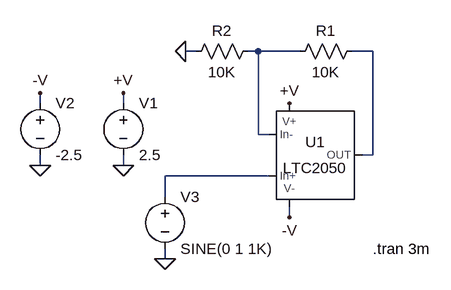
[diagram p0: schematic 2050.asc]
2050.asc, the LTspice schematic file:
Version 4
SHEET 1 896 680
WIRE -48 -64 -64 -64
WIRE 48 -64 32 -64
WIRE 112 -64 48 -64
WIRE 224 -64 192 -64
WIRE -288 16 -288 0
WIRE -160 16 -160 0
WIRE 48 64 48 -64
WIRE 64 64 48 64
WIRE 224 96 224 -64
WIRE 224 96 208 96
WIRE -288 112 -288 96
WIRE -160 112 -160 96
WIRE 64 128 -96 128
WIRE -96 160 -96 128
WIRE 96 192 96 176
WIRE -96 256 -96 240
FLAG -160 112 0
FLAG 96 16 +V
FLAG -160 0 +V
FLAG 96 192 -V
FLAG -288 112 0
FLAG -288 0 -V
FLAG -96 256 0
FLAG -64 -64 0
SYMBOL voltage -160 0 R0
SYMATTR InstName V1
SYMATTR Value 2.5
SYMBOL voltage -288 0 R0
SYMATTR InstName V2
SYMATTR Value -2.5
SYMBOL voltage -96 144 R0
SYMATTR InstName V3
SYMATTR Value SINE(0 1 1K)
SYMBOL res 208 -80 R90
WINDOW 0 0 56 VBottom 2
WINDOW 3 32 56 VTop 2
SYMATTR InstName R1
SYMATTR Value 10K
SYMBOL res 48 -80 R90
WINDOW 0 0 56 VBottom 2
WINDOW 3 32 56 VTop 2
SYMATTR InstName R2
SYMATTR Value 10K
SYMBOL opamps\\LTC2050 96 96 R0
SYMATTR InstName U1
TEXT 224 240 Left 2 !.tran 3m

The netlist it stands for:
* 2050.asc
V1 +V 0 2.5
V2 -V 0 -2.5
V3 N003 0 SINE(0 1 1K)
R1 N002 N001 10K
R2 N001 0 10K
XU1 N003 N001 +V -V N002 NC_01 LTC2050  ; pins In+ In- V+ V- OUT SHDN
.tran 3m
.backanno
.end